# Altium schematic sheet Motor-Z.SchDoc: Motor-Z
size Letter; SheetNumber: 10; SheetTotal: 11
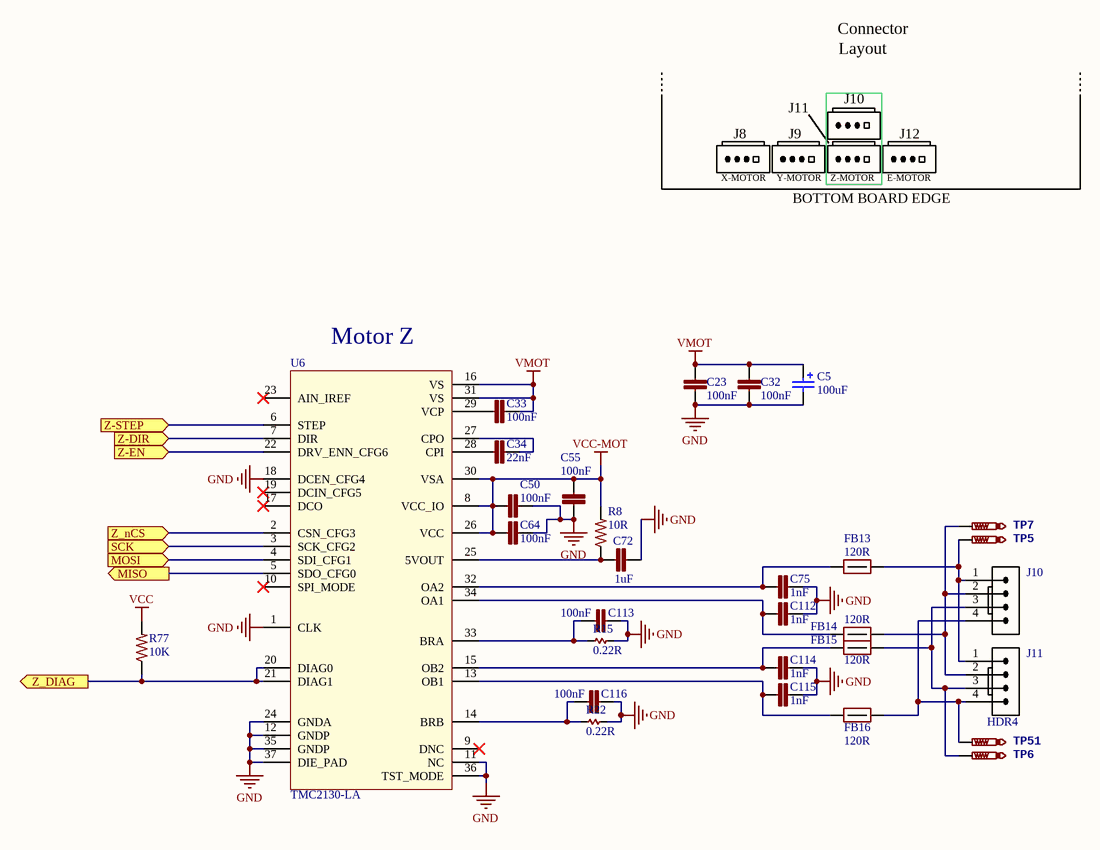
[diagram p0: Motor-Z.SchDoc]

## Parts
C5  value 100uF  [CAP-ELEC-063063077]  (hidden comment: UWT1V101MCL1GS)
C23  100nF  [C0603]
C32  100nF  [C0603]
C33  100nF  [C0603]
C34  22nF  [C0402]
C50  100nF  [C0402]
C55  100nF  [C0402]
C64  100nF  [C0402]
C72  1uF  [C0402]
C75  1nF  [C0603]
C112  1nF  [C0603]
C113  100nF  [C0603]
C114  1nF  [C0603]
C115  1nF  [C0603]
C116  100nF  [C0603]
FB13  120R  [FB0603]
FB14  120R  [FB0603]
FB15  120R  [FB0603]
FB16  120R  [FB0603]
J10  Molex 0705430003  [4POL254]  (value not drawn)
J11  value HDR4  [4POL254]  (hidden comment: Molex 0705430003)
R8  10R  [R0402]
R15  0.22R  [R1206]
R22  0.22R  [R1206]
R77  10K  [R0402]
TP5  TestPoint  [TP1-27]  (value not drawn)  (no BOM)
TP6  TestPoint  [TP1-27]  (value not drawn)  (no BOM)
TP7  TestPoint  [TP1-27]  (value not drawn)  (no BOM)
TP51  TestPoint  [TP1-27]  (value not drawn)  (no BOM)
U6  TMC2130-LA  [QFN36-50P500X600X900_HS-37N]

## Ports
MISO, MOSI, SCK, Z-DIR, Z-EN, Z-STEP, Z_DIAG, Z_nCS

## Nets
GND: C5.2 C23.1 C32.1 C50.1 C55.1 C64.1 C72.2 C75.2 C112.2 C113.1 C114.2 C115.2 C116.1 R15.2 R22.2 U6.1(CLK) U6.11(NC) U6.12(GNDP) U6.18(DCEN_CFG4) U6.24(GNDA) U6.35(GNDP) U6.36(TST_MODE) U6.37(DIE_PAD)
VCC: R77.2
VCC-MOT: C50.2 C55.2 C64.2 R8.2 U6.8(VCC_IO) U6.26(VCC) U6.30(VSA)
VMOT: C5.1 C23.2 C32.2 C33.2 U6.16(VS) U6.31(VS)
MISO: U6.5(SDO_CFG0) ; port MISO
MOSI: U6.4(SDI_CFG1) ; port MOSI
SCK: U6.3(SCK_CFG2) ; port SCK
Z-DIR: U6.7(DIR) ; port Z-DIR
Z-EN: U6.22(DRV_ENN_CFG6) ; port Z-EN
Z-STEP: U6.6(STEP) ; port Z-STEP
Z_DIAG: R77.1 U6.20(DIAG0) U6.21(DIAG1) ; port Z_DIAG
Z_nCS: U6.2(CSN_CFG3) ; port Z_nCS
NetC33_1: C33.1 U6.29(VCP)
NetC34_1: C34.1 U6.28(CPI)
NetC34_2: C34.2 U6.27(CPO)
NetC72_1: C72.1 R8.1 U6.25(5VOUT)
NetC75_1: C75.1 FB13.1 U6.32(OA2)
NetC112_1: C112.1 FB14.1 U6.34(OA1)
NetC113_2: C113.2 R15.1 U6.33(BRA)
NetC114_1: C114.1 FB15.1 U6.15(OB2)
NetC115_1: C115.1 FB16.1 U6.13(OB1)
NetC116_2: C116.2 R22.1 U6.14(BRB)
NetFB13_2: FB13.2 J10.1 J11.1 TP5.TP
NetFB14_2: FB14.2 J10.2 J11.2 TP7.TP
NetFB15_2: FB15.2 J10.3 J11.3 TP6.TP
NetFB16_2: FB16.2 J10.4 J11.4 TP51.TP

Not connected (* = marked no-connect by the designer): U6 9(DNC)* 10(SPI_MODE)* 17(DCO)* 19(DCIN_CFG5)* 23(AIN_IREF)*

## Notes on the sheet
- Connector
- Layout
- J8
- J9
- J11
- J10
- J12
- X-MOTOR
- Y-MOTOR
- BOTTOM BOARD EDGE
- Z-MOTOR
- E-MOTOR
- (near U6) Motor Z
- Title:
- Project:
- File:
- Ver:
- Drawn by:
- Sheet:
- of

## Library data of the parts
C5 = UWT1V101MCL1GS: CAP ALUM 100UF 35V 20% SMD; Manufacturer: Nichicon; Part Description: 100µF 35V Aluminum Capacitors Radial, Can - SMD 1000 Hrs @ 105°C; EE_SPEC: 100uF 35V Al-El; Tolerance: +/- 20%; MANUFACTURER #: UWT1V101MCL1GS; DISTRIBUTOR #: 493-2203-2-ND; DISTRIBUTOR: Digi-Key; PART: 100uF
C23 C32 C33 C113 C116 = C0603C104K5RACTU: CAP CER 0603 100nF 50V 10% X7R; Manufacturer: Kemet; Part Description: 0.1µF ±10% 50V Ceramic Capacitor X7R 0603 (1608 Metric); EE_SPEC: 100nF 50V X7R 0603; Tolerance: +/- 10%; VALUE: 100nF; MANUFACTURER #: C0603C104K5RACTU; DISTRIBUTOR #: 399-5089-2-ND; DISTRIBUTOR: Digi-Key; PART: 100nF
C34 = GCM155R71H223KA55D: CAP CER 0402 22nF ±10% 50V X7R; Manufacturer: YAGEO; Part Description: 0.022µF ±10% 50V Ceramic Capacitor X7R 0402 (1005 Metric); EE_SPEC: 22nF 50V X7R 0402; Tolerance: +/- 10%; VALUE: 22nF; MANUFACTURER #: GCM155R71H223KA55D; DISTRIBUTOR #: 490-4763-2-ND; DISTRIBUTOR: Digi-Key; PART: 22nF
C50 C55 C64 = GRM155R71C104KA88D: CAP CER 0402 100nF 16V 10% X7R; Manufacturer: Murata; Part Description: 0.10µF ±10% 16V Ceramic Capacitor X7R 0402 (1005 Metric); EE_SPEC: 100nF 16V X7R 0402; Tolerance: +/- 10%; VALUE: 100nF; MANUFACTURER #: GRM155R71C104KA88D; DISTRIBUTOR #: 490-3261-2-ND; DISTRIBUTOR: Digi-Key; PART: 100nF
C72 = GRM155R60J105KE19D: CAP CER 0402 1uF 6.3V 10% X5R; Manufacturer: Murata; Part Description: 1µF ±10% 6.3V Ceramic Capacitor X5R 0402 (1005 Metric); EE_SPEC: 1uF 6.3V X5R 0402; Tolerance: +/- 10%; VALUE: 1uF; MANUFACTURER #: GRM155R60J105KE19D; DISTRIBUTOR #: 490-1320-2-ND; DISTRIBUTOR: Digi-Key; PART: 1uF
C75 C112 C114 C115 = C0603C102K5RACTU: CAP CER 0603  1nF 50v 10% X7R; Manufacturer: Kemet; Part Description: 1000pF ±10% 50V Ceramic Capacitor X7R 0603 (1608 Metric); EE_SPEC: 1nF 50V X7R 0603; Tolerance: +/- 10%; VALUE: 1nF; MANUFACTURER #: C0603C102K5RACTU; DISTRIBUTOR #: 399-1082-2-ND; DISTRIBUTOR: Digi-Key; PART: 1nF
FB13-FB16 = FERRITE 120R 3A 0603: FERRITE BEAD 120 OHM 0603 1LN; MANUFACTURER: Samsung; MANUFACTURER #: CIS10P121AC; VALUE: 120Rfb; TOLERANCE: -NA-; EE_SPEC: 3A; DISTRIBUTOR #: 1276-6351-2-ND; DISTRIBUTOR: Digikey; PART: FERRITE 120R 3A 0603; PART DESCRIPTION: FERRITE BEAD 120 OHM 0603 1LN
J10 = CONN 4PIN 0.1" VERT SHRD LOCK ALT: Molex 4 Pin Clip Connector; MANUFACTURER #: 0705430038; PART: 4 Pin Conn; PART DESCRIPTION: 4 Positions Header, Shrouded Connector 0.100" (2.54mm) Through Hole Tin; TOLERANCE: -NA-; VALUE: HDR4; MANUFACTURER: Molex; DISTRIBUTOR #: WM4826-ND; DISTRIBUTOR: Digi-Key; EE_SPEC: -NA-
J11 = CONN 4PIN 0.1" VERT SHRD LOCK ALT: Molex 4 Pin Clip Connector; MANUFACTURER #: 0705430038; PART: 4 Pin Conn; PART DESCRIPTION: 4 Positions Header, Shrouded Connector 0.100" (2.54mm) Through Hole Tin; TOLERANCE: -NA-; MANUFACTURER: Molex; DISTRIBUTOR #: WM4826-ND; DISTRIBUTOR: Digi-Key; EE_SPEC: -NA-
R8 = RC0402FR-0710RL: RES SMD 10 OHM 1% 1/16W 0402; Manufacturer: Yageo; Part Description: 10 Ohm ±1% 0.063W, 1/16W Chip Resistor 0402 (1005 Metric) Moisture Resistant Thick Film; EE_SPEC: 10R 1% 0402; Tolerance: +/- 1%; VALUE: 10R; MANUFACTURER #: RC0402FR-0710RL; DISTRIBUTOR #: 311-10.0LRTR-ND; DISTRIBUTOR: Digi-Key; PART: 10R
R15 R22 = 0.22R 1% 1206: RES SMD 0.22 OHM 1% 1/3W 1206; Manufacturer: Panasonic; MANUFACTURER #: RUT3216FR220CS; Tolerance: +/- 1%; DISTRIBUTOR #: RUT3216FR220CS; DISTRIBUTOR: Digi-Key; EE_SPEC: 0.22R 1% 1206; PART: 0.22R; Part Description: RES SMD 0.22 OHM 1% 1/3W 1206; VALUE: 0.22R
R77 = RC0402FR-0710KP: RES SMD 10K OHM 1% 1/16W 0402; MANUFACTURER: Yageo; PART: 10k 1% 0402; PART DESCRIPTION: 10k Ohm ±1% 0.063W, 1/16W Chip Resistor 0402 (1005 Metric) Moisture Resistant Thick Film; EE_SPEC: 10k 1% 0402 1/16W; VALUE: 10K; MANUFACTURER #: RC0402FR-0710KP; DISTRIBUTOR #: YAG1249TR-ND; DISTRIBUTOR: Digi-Key; TOLERANCE: 1%
TP5-TP7 TP51 = TestPoint: Test Point
U6 = TMC2130-LA-T: IC STEPPER MOTOR DVR SPI 36QFN; Manufacturer: Trinamic; Part Description: Bipolar Motor Driver Power MOSFET SPI, Step/Direction 36-QFN (5x6); EE_SPEC: 46V 1.2A 1/256 Step; Tolerance: NA; DISTRIBUTOR #: 1460-1130-2-ND; DISTRIBUTOR: Digi-Key; MANUFACTURER #: TMC2130-LA-T; PART: TMC2130; VALUE: TMC2130